# EAGLE design RPi_Clock_I2C (EAGLE 6.4)
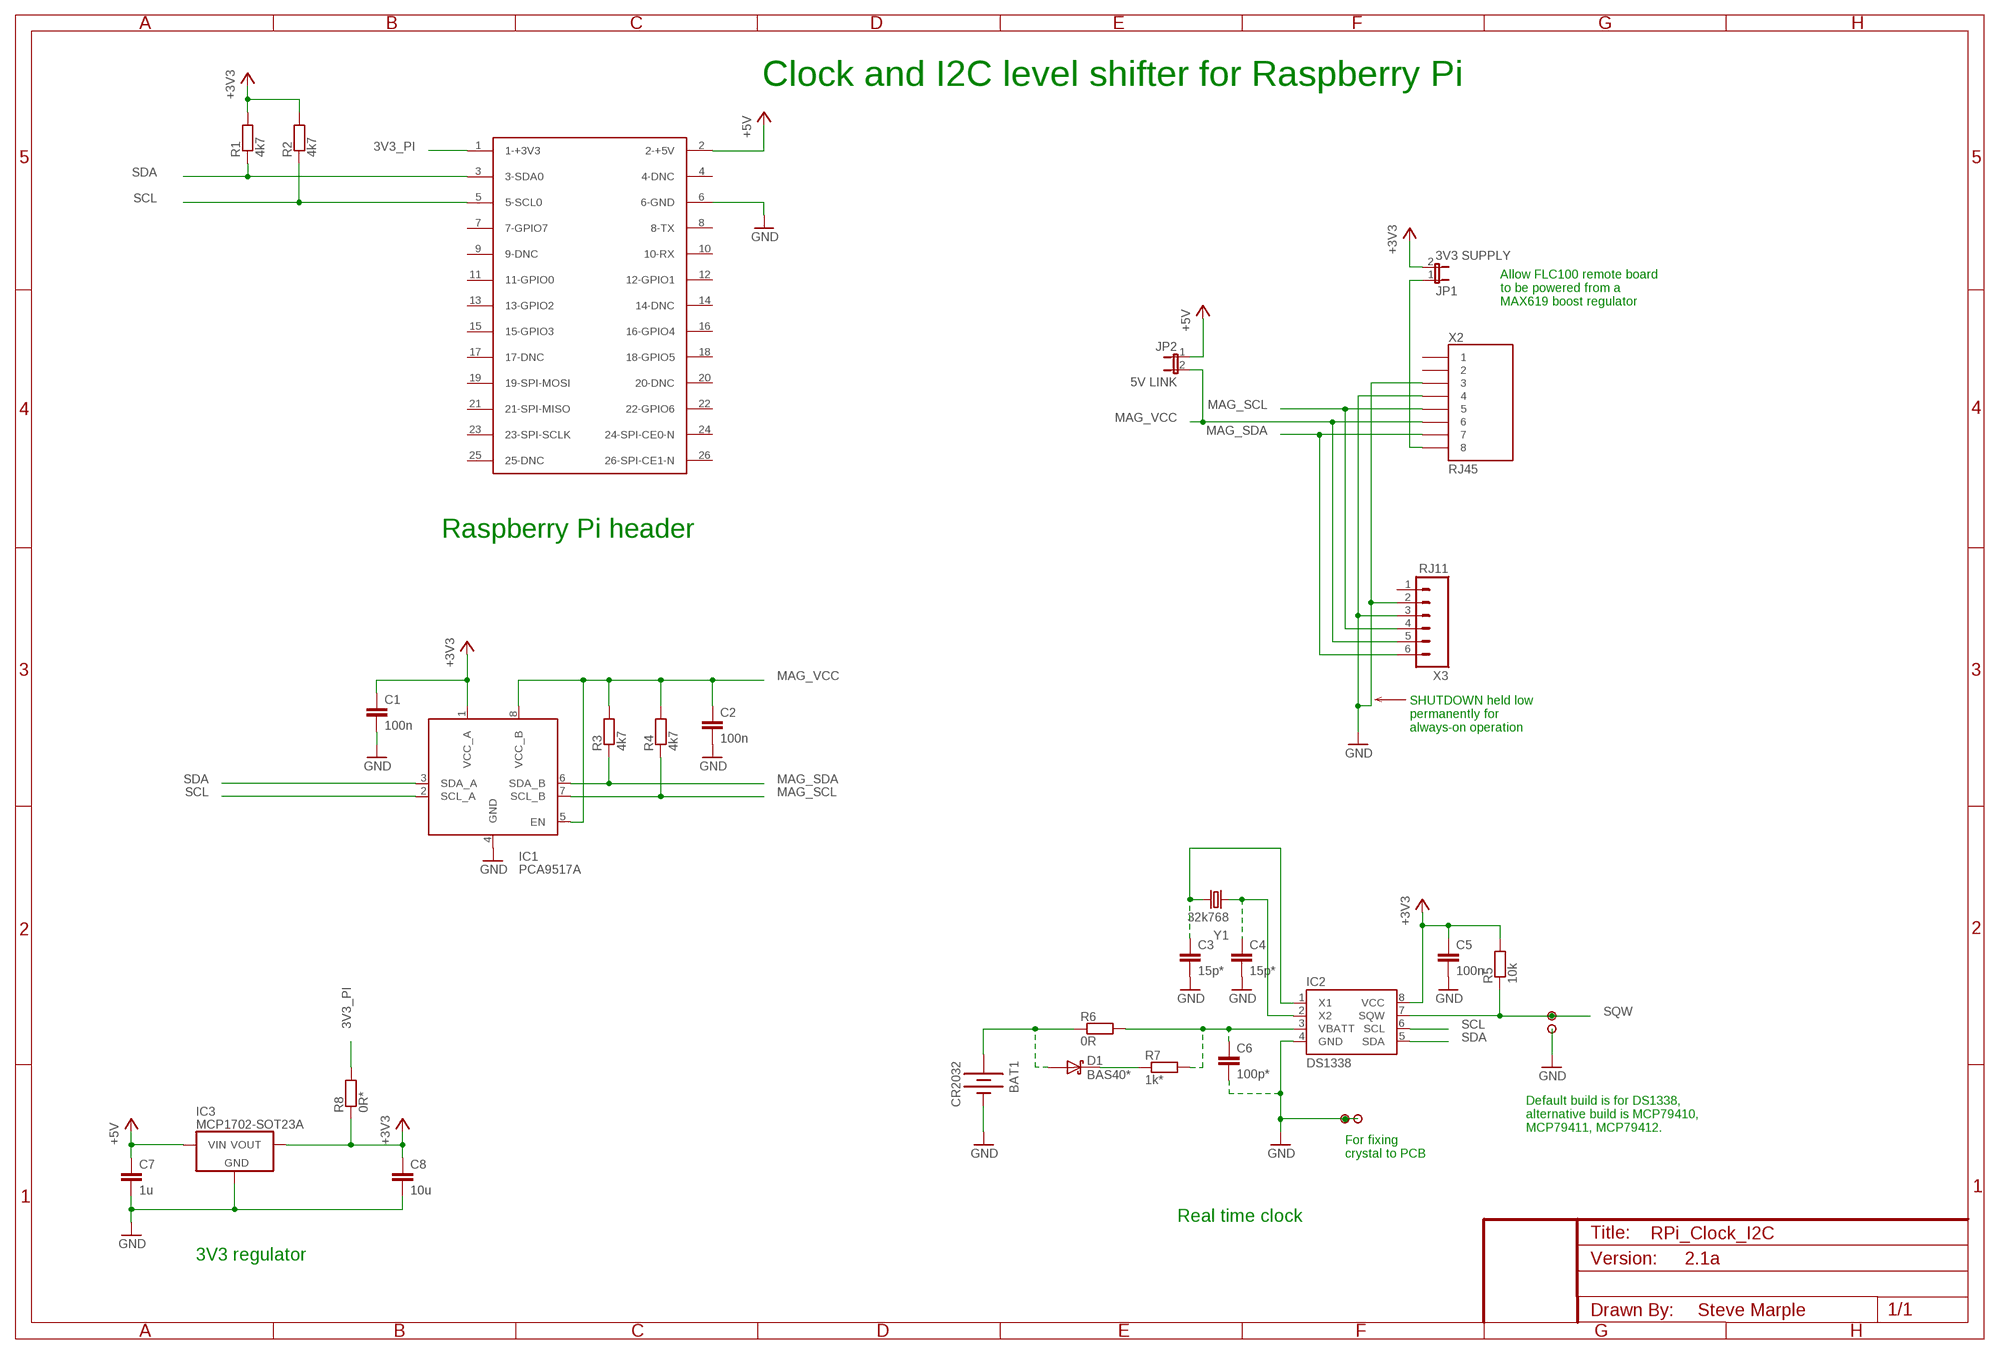
[diagram p0: schematic, sheet 1]

## Parts
BAT1  CR2032  BATTERY20PTH  [BATTCOM_20MM_PTH]
C1  100n  C-EU1206-HAND  [1206-HAND]
C2  100n  C-EU1206-HAND  [1206-HAND]
C3  15p*  C-EU0805-HAND  [0805-HAND]
C4  15p*  C-EU0805-HAND  [0805-HAND]
C5  100n  C-EU1206-HAND  [1206-HAND]
C6  100p*  C-EU1206-HAND  [1206-HAND]
C7  1u  C-EU1206-HAND  [1206-HAND]
C8  10u  C-EU1206-HAND  [1206-HAND]
D1  BAS40*  DIODE-SCHOTTKYSOT23-1-3-HAND  [SOT23-3-HAND]
IC1  PCA9517A  PCA9517ASOIC  [SO08]
IC2  DS1338  DS1307SO08  [SO08]
IC3  MCP1702-SOT23A  MCP1702SOT23-HAND  [SOT23-3-HAND]
JP1  3V3 SUPPLY  JUMPER-2PTH  [1X02]
JP2  5V LINK  JUMPER-2PTH  [1X02]
R1  4k7  RESISTOR1206-HAND  [1206-HAND]
R2  4k7  RESISTOR1206-HAND  [1206-HAND]
R3  4k7  RESISTOR1206-HAND  [1206-HAND]
R4  4k7  RESISTOR1206-HAND  [1206-HAND]
R5  10k  RESISTOR1206-HAND  [1206-HAND]
R6  0R  RESISTOR1206-HAND  [1206-HAND]
R7  1k*  RESISTOR1206-HAND  [1206-HAND]
R8  0R*  RESISTOR1206-HAND  [1206-HAND]
U$1  PAD  [PAD]
U$2  PAD  [PAD]
U$3  PADSMALL  [PAD-SMALL]
U$4  PADSMALL  [PAD-SMALL]
X1  P1  RASPBERRY-PIHEADER  [RASPBERRY-PI-HEADER]
X2  RJ45  RJ45-8PTH  [RJ45-8]
X3  RJ11  RJ11-6PTH  [RJ11-6]
Y1  32k768  CRYSTALTC38H  [TC38H]

## Nets
3V3_PI [power]: R8.2 X1.1(1-+3V3)
+3V3 [power]: C1.1 C5.1 C8.1 IC1.1(VCC_A) IC2.8(VCC) IC3.2(VOUT) JP1.2 R1.2 R2.2 R5.2 R8.1
+5V [power]: C7.1 IC3.3(VIN) JP2.1 X1.2(2-+5V)
GND [power]: BAT1.2(-) C1.2 C2.2 C3.2 C4.2 C5.2 C6.2 C7.2 C8.2 IC1.4(GND) IC2.4(GND) IC3.1(GND) U$2.1 U$3.1 U$4.1 X1.6(6-GND) X2.3 X2.4 X3.2 X3.3
MAG_SCL: IC1.7(SCL_B) R4.1 X2.5 X3.4
MAG_SDA: IC1.6(SDA_B) R3.1 X2.7 X3.6
MAG_VCC [power]: C2.1 IC1.5(EN) IC1.8(VCC_B) JP2.2 R3.2 R4.2 X2.6 X3.5
N$5: C3.1 IC2.1(X1) Y1.1
N$9: D1.3(C) R7.1
N$11: C6.1 IC2.3(VBATT) R6.2 R7.2
N$12: C4.1 IC2.2(X2) Y1.2
N$26 [power]: JP1.1 X2.8
SCL: IC1.2(SCL_A) IC2.6(SCL) R2.1 X1.5(5-SCL0)
SDA: IC1.3(SDA_A) IC2.5(SDA) R1.1 X1.3(3-SDA0)
SQW: IC2.7(SQW) R5.1 U$1.1
VBATT: BAT1.1(+) D1.1(A) R6.1
Unconnected: X1.4(4-DNC) X1.7(7-GPIO7) X1.8(8-TX) X1.9(9-DNC) X1.10(10-RX) X1.11(11-GPIO0) X1.12(12-GPIO1) X1.13(13-GPIO2) X1.14(14-DNC) X1.15(15-GPIO3) X1.16(16-GPIO4) X1.17(17-DNC) X1.18(18-GPIO5) X1.19(19-SPI-MOSI) X1.20(20-DNC) X1.21(21-SPI-MISO) X1.22(22-GPIO6) X1.23(23-SPI-SCLK) X1.24(24-SPI-CE0-N) X1.25(25-DNC) X1.26(26-SPI-CE1-N) X2.1 X2.2 X3.1

## Notes on the sheet
- Clock and I2C level shifter for Raspberry Pi
- Allow FLC100 remote board
  to be powered from a
  MAX619 boost regulator
- Raspberry Pi header
- SHUTDOWN held low
  permanently for 
  always-on operation
- Default build is for DS1338,
  alternative build is MCP79410,
  MCP79411, MCP79412.
- For fixing
  crystal to PCB
- Real time clock
- 3V3 regulator | 2.1a
- Steve Marple

## Library data of the parts
BAT1 = SteveMarple:BATTERY: Battery Holders Various common sizes : AA, AAA, 20mm coin cell and 12mm coin cell.
C1-C8 = SteveMarple:C-EU
D1 = SteveMarple:DIODE-SCHOTTKY
IC1 = SteveMarple:PCA9517A
IC2 = SteveMarple:DS1307
IC3 = SteveMarple:MCP1702: Microchip MCP1702 250mA low quiescent current (2uA) LDO voltage regulator.
JP1 JP2 = SparkFun:JUMPER-2: Jumper Basic 0.1" spaced jumper. Use with breakaway headers.
R1-R8 = SteveMarple:RESISTOR: 1/4W PTH resistor
U$1-U$4 = SteveMarple:PAD
X1 = SteveMarple:RASPBERRY-PI: Raspberry Pi Board <http://www.raspberrypi.org/> Jacques Lagnel V1.0 (beta) 2012 Board dimension: Forum 3D model <http://www.raspberrypi.org/forum/general-discussion/mechanical-profile-3d-models?value=3d%20model&type=1&include=1&search=1&ret=all> The GPIO Connector (P1): http://elinux.org/RPi_Low-level_peripherals
X2 = SteveMarple:RJ45-8: RJ45 Jack Simple RJ45, 8-pin connection - connector for common Cat5, Cat5e, and Cat6 Ethernet cables. Footprint not yet proven in production. Connector sku is PRT-00643; Breakout PCB sku is BOB-00716.
X3 = SteveMarple:RJ11-6: RJ11 Jack Simple 6 pin RJ11 jack. Commonly found on CAT3 devices and Microchip programmers. SKU: PRT-00132
Y1 = SteveMarple:CRYSTAL: Crystals Various standard crystals. Proven footprints. Spark Fun Electronics SKU : COM-00534

## Net classes
1 power: width 0.381 mm
2 5V: width 0.381 mm
3 antenna: width 0.61 mm

## Board
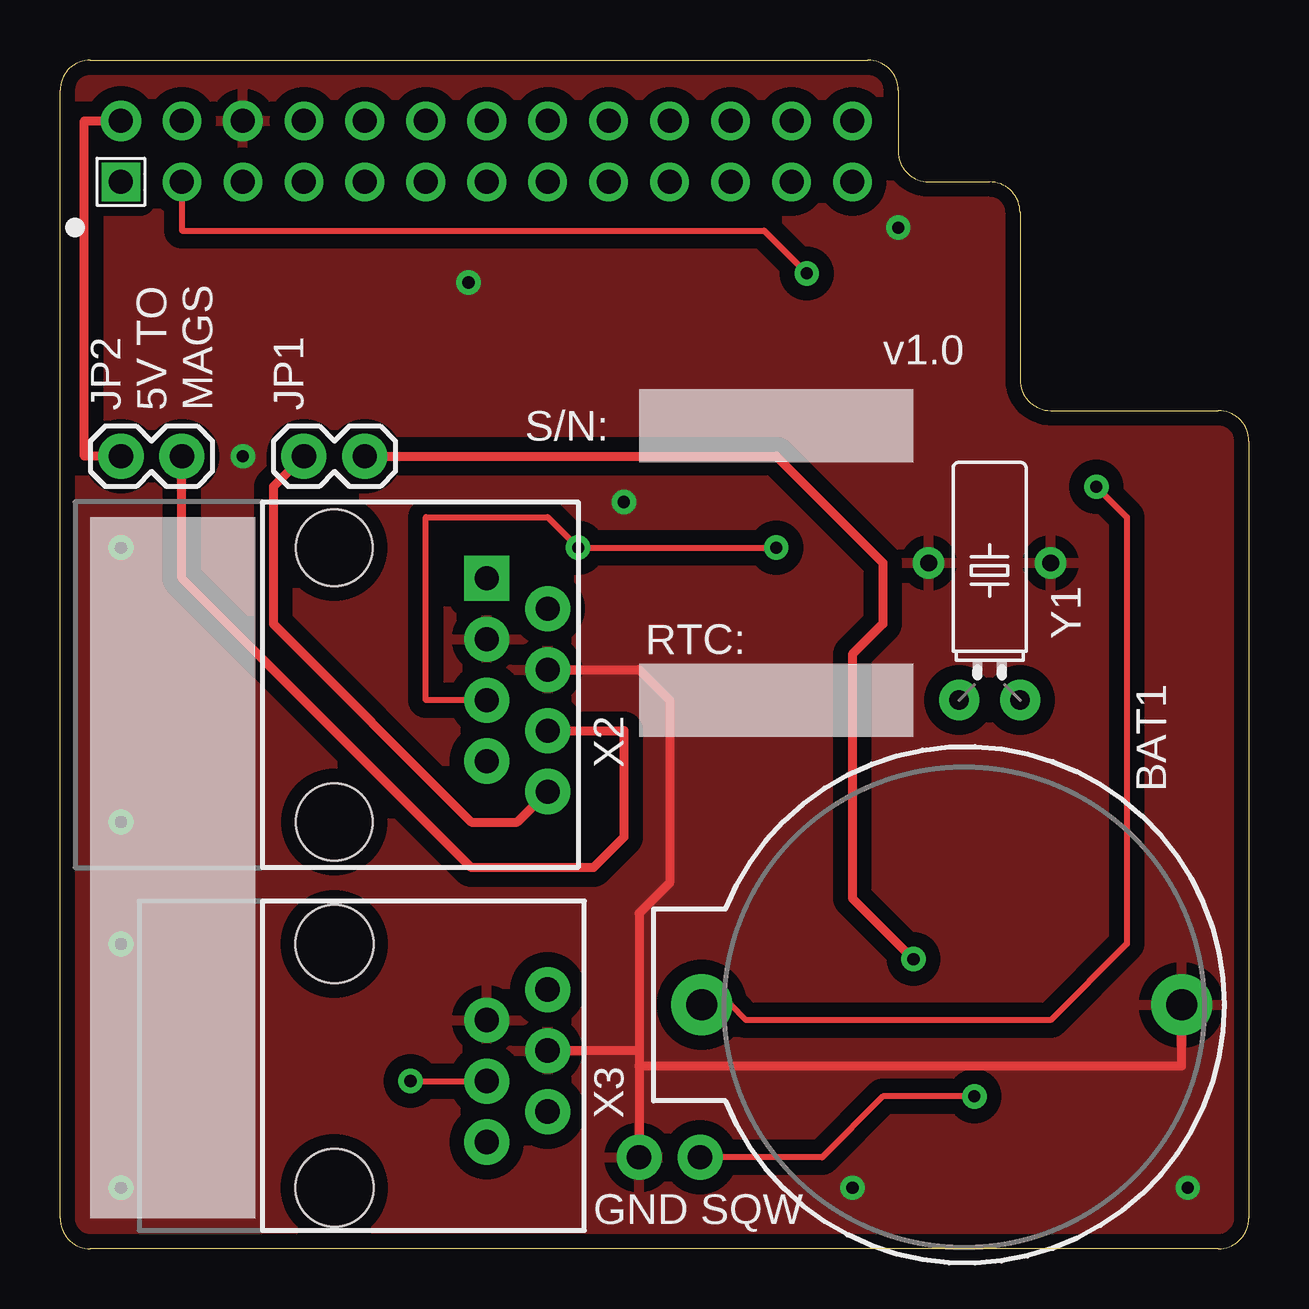
[diagram p1: board, top side]
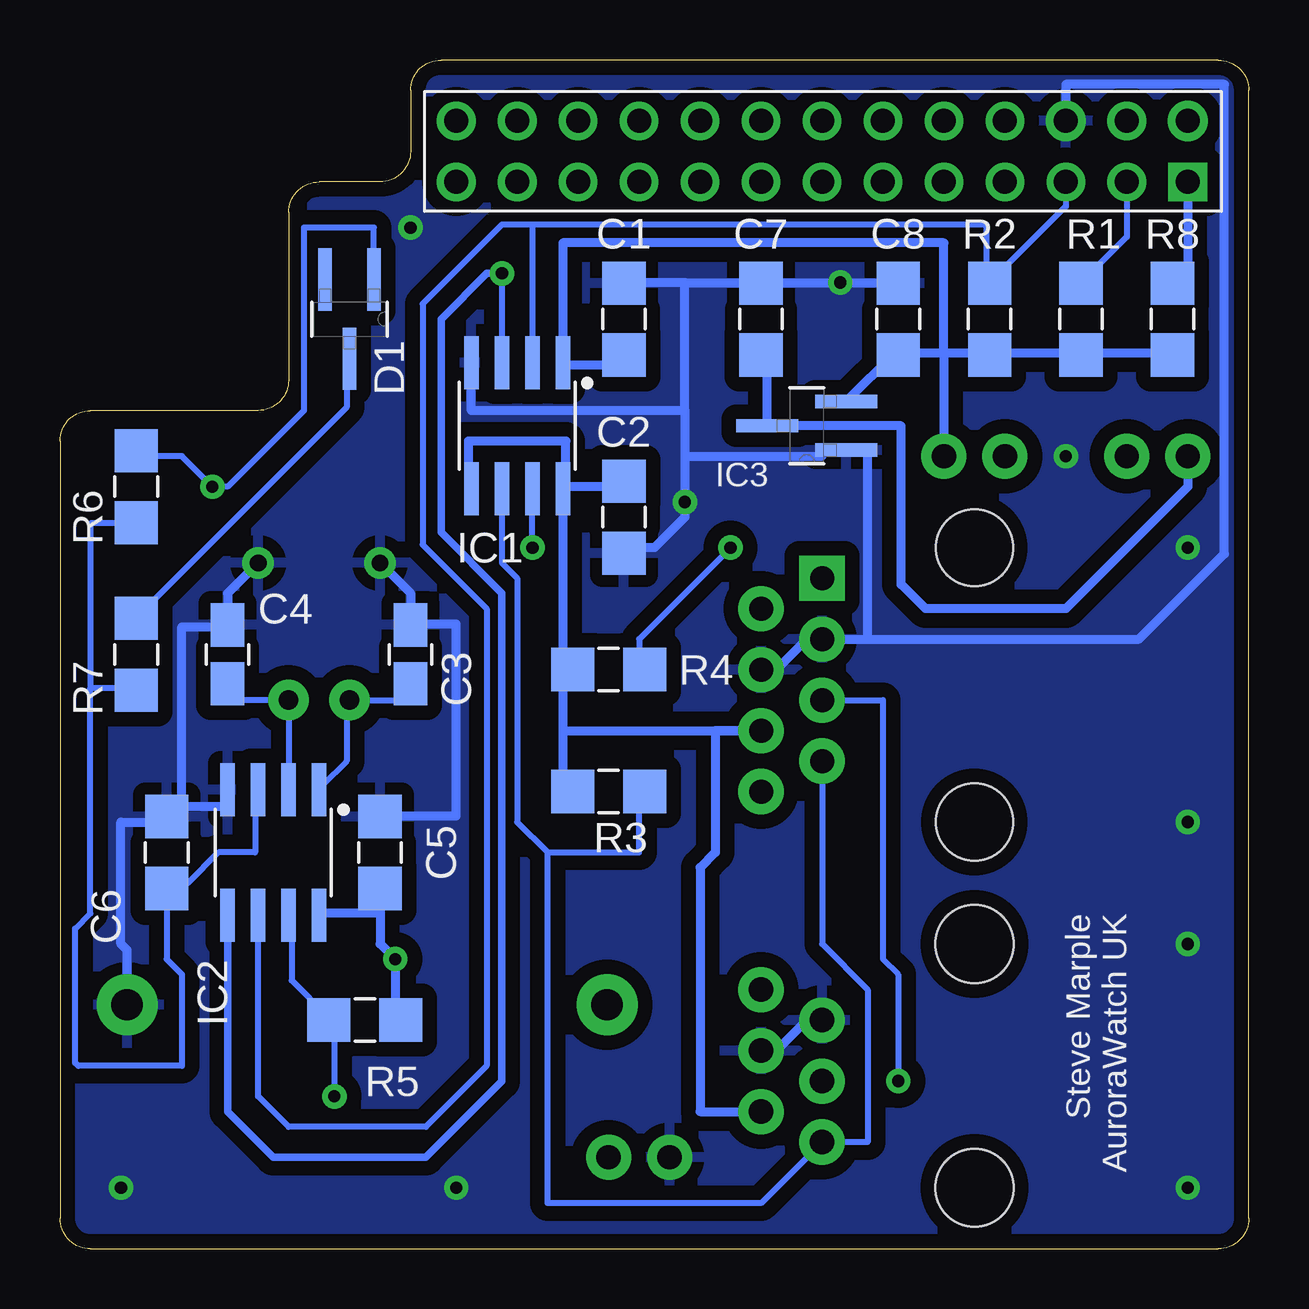
[diagram p2: board, bottom side, seen from below]

Size 49.53 x 49.53 mm. Coordinates in mm from the lower left corner, seen from the top.
Outline: 0,1.27 0,48.26 arc-90 1.27,49.53 33.66,49.53 arc-90 34.92,48.26 34.92,45.72 arc90 36.2,44.45 38.73,44.45 arc-90 40.01,43.18 40.01,36.2 arc90 41.27,34.92 48.26,34.92 arc-90 49.53,33.66 49.53,1.27 arc-90 48.26,0 1.27,0 arc-90 0,1.27
Copper layers (1*16): Top 0.035mm / dielectric 1.5mm / Bottom 0.035mm
Design rules "SparkFun_Iteadstudio_10_12mil": minimum track width 10mil, minimum drill 20mil, track to track 12mil, track to pad 12mil, pad to pad 12mil, via to via 12mil, smd to smd 12mil, copper to edge 0.5mm, drill to drill 8mil, minimum pad ring 12mil, minimum via ring 10mil, stop-mask expansion 4mil, vias tented up to drill 25mil, thermal gap 20mil

### Footprints (pad centres in the part's own frame; a part is rotated, then mirrored left to right if it is on the bottom)
BATTCOM_20MM_PTH = drill 1.3 pad 2.54: 1 20,0; 2 0,0
1206-HAND = smd 1.8 x 1.803: 1 -1.499,0; 2 1.499,0
0805-HAND = smd 1.8 x 1.4: 1 -1.225,0; 2 1.225,0
SOT23-3-HAND = smd 2.591 x 0.559: 1 -1.651,1.016; 2 -1.651,-1.016; 3 1.651,0
SO08 = smd 0.61 x 2.21: 1 -1.905,-2.616; 2 -0.635,-2.616; 3 0.635,-2.616; 4 1.905,-2.616; 5 1.905,2.616; 6 0.635,2.616; 7 -0.635,2.616; 8 -1.905,2.616
1X02 = drill 1.016 pad 1.88: 1 0,0; 2 2.54,0
PAD = drill 1.016 pad 1.88: 1 0,0
PAD-SMALL = drill 0.7 pad 1.27: 1 0,0
RASPBERRY-PI-HEADER = drill 1 square: 1 0,0 | drill 1 pad 1.676: 2 0,2.54; 6 5.08,2.54 | drill 1: 3 2.54,0; 4 2.54,2.54; 5 5.08,0; 7 7.62,0; 8 7.62,2.54; 9 10.16,0; 10 10.16,2.54; 11 12.7,0; 12 12.7,2.54; 13 15.24,0; 14 15.24,2.54; 15 17.78,0; 16 17.78,2.54; 17 20.32,0; 18 20.32,2.54; 19 22.86,0; 20 22.86,2.54; 21 25.4,0; 22 25.4,2.54; 23 27.94,0; 24 27.94,2.54; 25 30.48,0; 26 30.48,2.54
RJ45-8 = drill 1 pad 1.88 square: 1 -4.445,6.35 | drill 1 pad 1.88: 2 -3.175,8.89; 3 -1.905,6.35; 4 -0.635,8.89; 5 0.635,6.35; 6 1.905,8.89; 7 3.175,6.35; 8 4.445,8.89 | hole 3.2: -5.715,0; 5.715,0
RJ11-6 = drill 1.016 pad 1.88: 1 1.905,8.89; 2 3.175,6.35; 3 4.445,8.89; 4 5.715,6.35; 5 6.985,8.89; 6 8.255,6.35 | hole 3.251: 0,0; 10.16,0
TC38H = drill 0.813 pad 1.676: 1 -1.27,0; 2 1.27,0

### Placement (x,y rotation side)
BAT1  46.74,10.16 180 top
C1  26.04,38.73 90 bottom
C2  26.04,30.48 270 bottom
C3  34.92,24.77 90 bottom
C4  42.55,24.77 90 bottom
C5  36.2,16.51 90 bottom
C6  45.09,16.51 90 bottom
C7  20.32,38.73 90 bottom
C8  14.61,38.73 90 bottom
D1  37.47,38.73 270 bottom
IC1  30.48,34.29 180 bottom
IC2  40.64,16.51 180 bottom
IC3  18.41,34.29 180 bottom
JP1  10.16,33.02 0 top
JP2  2.54,33.02 0 top
R1  6.99,38.73 270 bottom
R2  10.79,38.73 270 bottom
R3  26.67,19.05 180 bottom
R4  26.67,24.13 180 bottom
R5  36.83,9.53 0 bottom
R6  46.35,31.75 270 bottom
R7  46.35,24.77 270 bottom
R8  3.17,38.73 90 bottom
U$1  26.67,3.81 0 top
U$2  24.13,3.81 0 top
U$3  36.2,28.57 0 top
U$4  41.27,28.57 0 top
X1  2.54,44.45 0 top
X2  11.43,23.5 270 top
X3  11.43,12.7 270 top
Y1  38.73,22.86 0 top

### Tracks (layer width: path | path; a pad name or v marks a point on that pad's centre or on a via)
3V3_PI
  Bottom 0.381: X1.1 2.54,40.89 3.05,40.39 R8.2
+3V3  (via drill 0.51)
  Top 0.381: v35.56,12.06 33.02,14.61 33.02,24.77 34.29,26.04 34.29,28.57 29.84,33.02 JP1.2
  Bottom 0.381: 36.2,13.97 36.2,14.61 36.07,14.99 C5.1 36.07,15.24 | 36.2,13.97 36.2,12.7 v35.56,12.06 35.56,9.65 R5.2 | 36.2,13.97 38.61,13.97 IC2.8 | 28.45,36.83 IC1.1 | R8.1 3.3,37.34 6.86,37.34 R1.2 7.11,37.34 10.67,37.34 R2.2 10.92,37.34 12.7,37.34 | 12.7,37.34 14.48,37.34 C8.1 14.73,37.34 IC3.2 | 28.45,36.83 28.57,36.83 28.57,41.91 12.7,41.91 12.7,37.34 | 28.45,36.83 26.04,36.83 C1.1 | C1.1 26.8,36.83 26.67,36.96 C1.1 | 12.7,37.34 JP1.2
+5V
  Top 0.381: X1.2 1.02,46.99 1.02,33.02 JP2.1
  Bottom 0.381: C7.1 20.32,37.08 20.07,36.83 IC3.3 14.48,34.29 14.48,27.69 13.46,26.67 7.62,26.67 2.54,31.75 JP2.1
GND  (via drill 0.51)
  Top 0.381: 24.13,8.26 X3.3 | 24.13,8.26 24.13,13.97 25.4,15.24 25.4,22.86 24.13,24.13 X2.4 | 24.13,8.26 24.13,7.62 | 24.13,7.62 U$2.1 | BAT1.2 46.74,7.62 24.13,7.62
  Bottom 0.381: 34.92,26.04 34.92,27.3 U$3.1 | 34.92,26.04 35.05,26.16 C3.2 | U$4.1 42.55,27.3 42.55,26.04 42.42,26.16 C4.2 42.67,25.91 44.45,25.91 44.45,18.41 | C5.2 36.07,18.03 33.02,18.03 33.02,26.04 34.92,26.04 | 44.45,18.41 42.67,18.41 42.67,19.05 IC2.4 | 44.45,18.41 44.96,18.03 C6.2 45.21,17.78 46.99,17.78 46.99,12.7 46.74,12.45 BAT1.2 | 20.32,40.26 14.73,40.26 C8.2 | 32.51,36.96 IC1.4 32.38,34.92 23.5,34.92 | 23.5,34.92 23.5,33.02 | 23.5,33.02 23.5,30.48 24.77,29.21 26.67,29.21 C2.2 | 23.5,40.26 26.04,40.26 C1.2 | 23.5,33.02 17.78,33.02 17.78,33.27 IC3.1 15.88,33.27 15.88,25.4 | 23.5,40.26 20.32,40.26 | 23.5,34.92 23.5,40.26 | 20.32,40.26 C7.2 | X3.3 19.68,8.26 18.41,9.53 X3.2 | X1.6 7.62,48.51 1.02,48.51 1.02,28.96 4.57,25.4 15.88,25.4 | 15.88,25.4 X2.3 18.41,25.4 19.68,24.13 X2.4 | 34.92,26.04 C3.2 | C3.2 34.97,25.99 34.92,26.04
  other vias: 7.62,33.02 17.02,40.26 2.54,2.54 2.54,12.7 2.54,17.78 2.54,29.21 33.02,2.54 46.99,2.54 34.92,42.55 23.5,31.11
  pour Top (isolate 0.61): 36.83,25.4 40.64,25.4 40.64,33.27 36.83,33.27
  pour Top (isolate 0.61, rank 2): 55.88,-6.35 55.88,54.61 -5.08,54.61 -5.08,-6.35
  pour Bottom (isolate 0.61): 52.07,-2.54 52.07,52.07 -2.54,52.07 -2.54,-2.54
MAG_SCL  (via drill 0.51)
  Top 0.254: X2.5 15.24,22.86 15.24,30.48 20.32,30.48 v21.59,29.21 v29.84,29.21 | v14.61,6.99 X3.4
  Bottom 0.254: v21.59,29.21 25.4,25.4 25.4,24.13 R4.1 | v29.84,29.21 29.84,31.37 29.72,31.62 IC1.7 | v14.61,6.99 14.61,11.43 15.24,12.06 15.24,22.86 X2.5
MAG_SDA
  Bottom 0.254: 25.4,19.05 25.27,19.18 25.4,19.68 25.4,19.05 | 25.4,19.05 25.4,16.51 29.21,16.51 | 29.21,16.51 30.48,17.78 30.48,27.94 31.11,28.57 IC1.6 | 25.4,19.05 R3.1 | X2.7 17.78,12.7 15.88,10.79 15.88,4.45 X3.6 20.32,1.91 29.21,1.91 29.21,16.51
MAG_VCC
  Top 0.381: JP2.2 5.08,27.94 17.14,15.88 22.23,15.88 23.5,17.14 23.5,21.59 X2.6
  Bottom 0.381: 28.57,24.13 28.57,21.59 | 28.57,21.59 28.57,19.05 R3.2 | 28.45,31.88 28.57,31.75 | 26.67,31.75 | 26.67,31.75 26.29,31.75 26.29,31.88 C2.1 | 28.45,31.88 28.45,33.66 32.51,33.66 32.51,31.88 IC1.5 | 28.45,31.88 IC1.8 | 26.67,31.75 28.57,31.75 | 28.57,31.75 28.57,24.13 | 28.57,24.13 R4.2 | X3.5 22.86,5.71 22.86,15.88 22.23,16.51 22.23,21.59 X2.6 28.57,21.59
N$5
  Bottom 0.254: C3.1 35.05,22.86 Y1.1 37.59,22.86 37.59,20.32 38.61,19.3 IC2.1
N$9
  Bottom 0.254: R7.1 46.23,26.42 37.59,35.05 37.59,37.08 D1.3
N$11
  Bottom 0.254: 48.26,23.37 46.48,23.37 | 48.26,23.37 48.26,30.23 46.48,30.23 R6.2 | 46.48,23.37 R7.2 46.35,23.37 | IC2.3 41.4,19.05 41.4,16.51 42.93,16.51 44.2,15.24 44.96,15.24 C6.1 45.09,12.06 44.45,11.43 44.45,7.62 48.77,7.62 48.9,7.75 48.9,13.34 48.26,13.97 48.26,23.37 | 46.48,23.37 46.35,23.37 | 46.35,23.37 46.35,23.5
N$12
  Bottom 0.254: C4.1 42.42,22.86 Y1.2 IC2.2
N$26
  Top 0.381: X2.8 19.05,17.78 17.14,17.78 8.89,26.04 8.89,31.75 JP1.1
SCL
  Bottom 0.254: X1.5 7.62,43.43 10.67,40.39 R2.1 10.92,40.39 10.92,42.67 29.84,42.67 | 29.84,42.67 29.84,37.21 29.72,36.96 IC1.2 | 29.84,42.67 31.11,42.67 34.42,39.37 34.42,29.34 31.75,26.67 31.75,7.62 34.29,5.08 40.01,5.08 41.27,6.35 41.27,13.34 41.15,13.72 IC2.6
SDA  (via drill 0.51)
  Top 0.254: v31.11,40.64 29.34,42.42 5.08,42.42 X1.3
  Bottom 0.254: X1.3 5.08,42.16 6.86,40.39 R1.1 | v31.11,40.64 31.11,37.47 30.99,36.96 IC1.3
  Bottom 0.305: v31.11,40.64 31.75,40.64 33.66,38.73 33.66,29.84 31.11,27.3 31.11,6.99 34.29,3.81 40.64,3.81 42.55,5.71 IC2.5
SQW  (via drill 0.51)
  Top 0.254: U$1.1 31.75,3.81 34.29,6.35 v38.1,6.35
  Bottom 0.254: IC2.7 39.88,13.72 39.88,11.18 38.35,9.65 R5.1 38.1,9.4 v38.1,6.35
VBATT  (via drill 0.51)
  Top 0.254: BAT1.1 27.94,10.16 28.57,9.53 41.27,9.53 44.45,12.7 44.45,30.48 v43.18,31.75
  Bottom 0.254: D1.1 36.45,42.55 39.37,42.55 39.37,34.92 42.55,31.75 v43.18,31.75 44.45,33.02 45.72,33.02 45.97,33.27 46.23,33.27 R6.1

### Text on the board
tNames: v1.0 | 5V TO / MAGS | S/N: | RTC:
tValues: Raspberry Pi / magnetometer / and clock | 3V3 TO / MAGS
bValues: MCP1702 | 3V3
_tsilk: GND | SQW
_bsilk: Steve Marple / AuroraWatch UK